# EAGLE design DFF_1_0 (EAGLE 8.3.2)
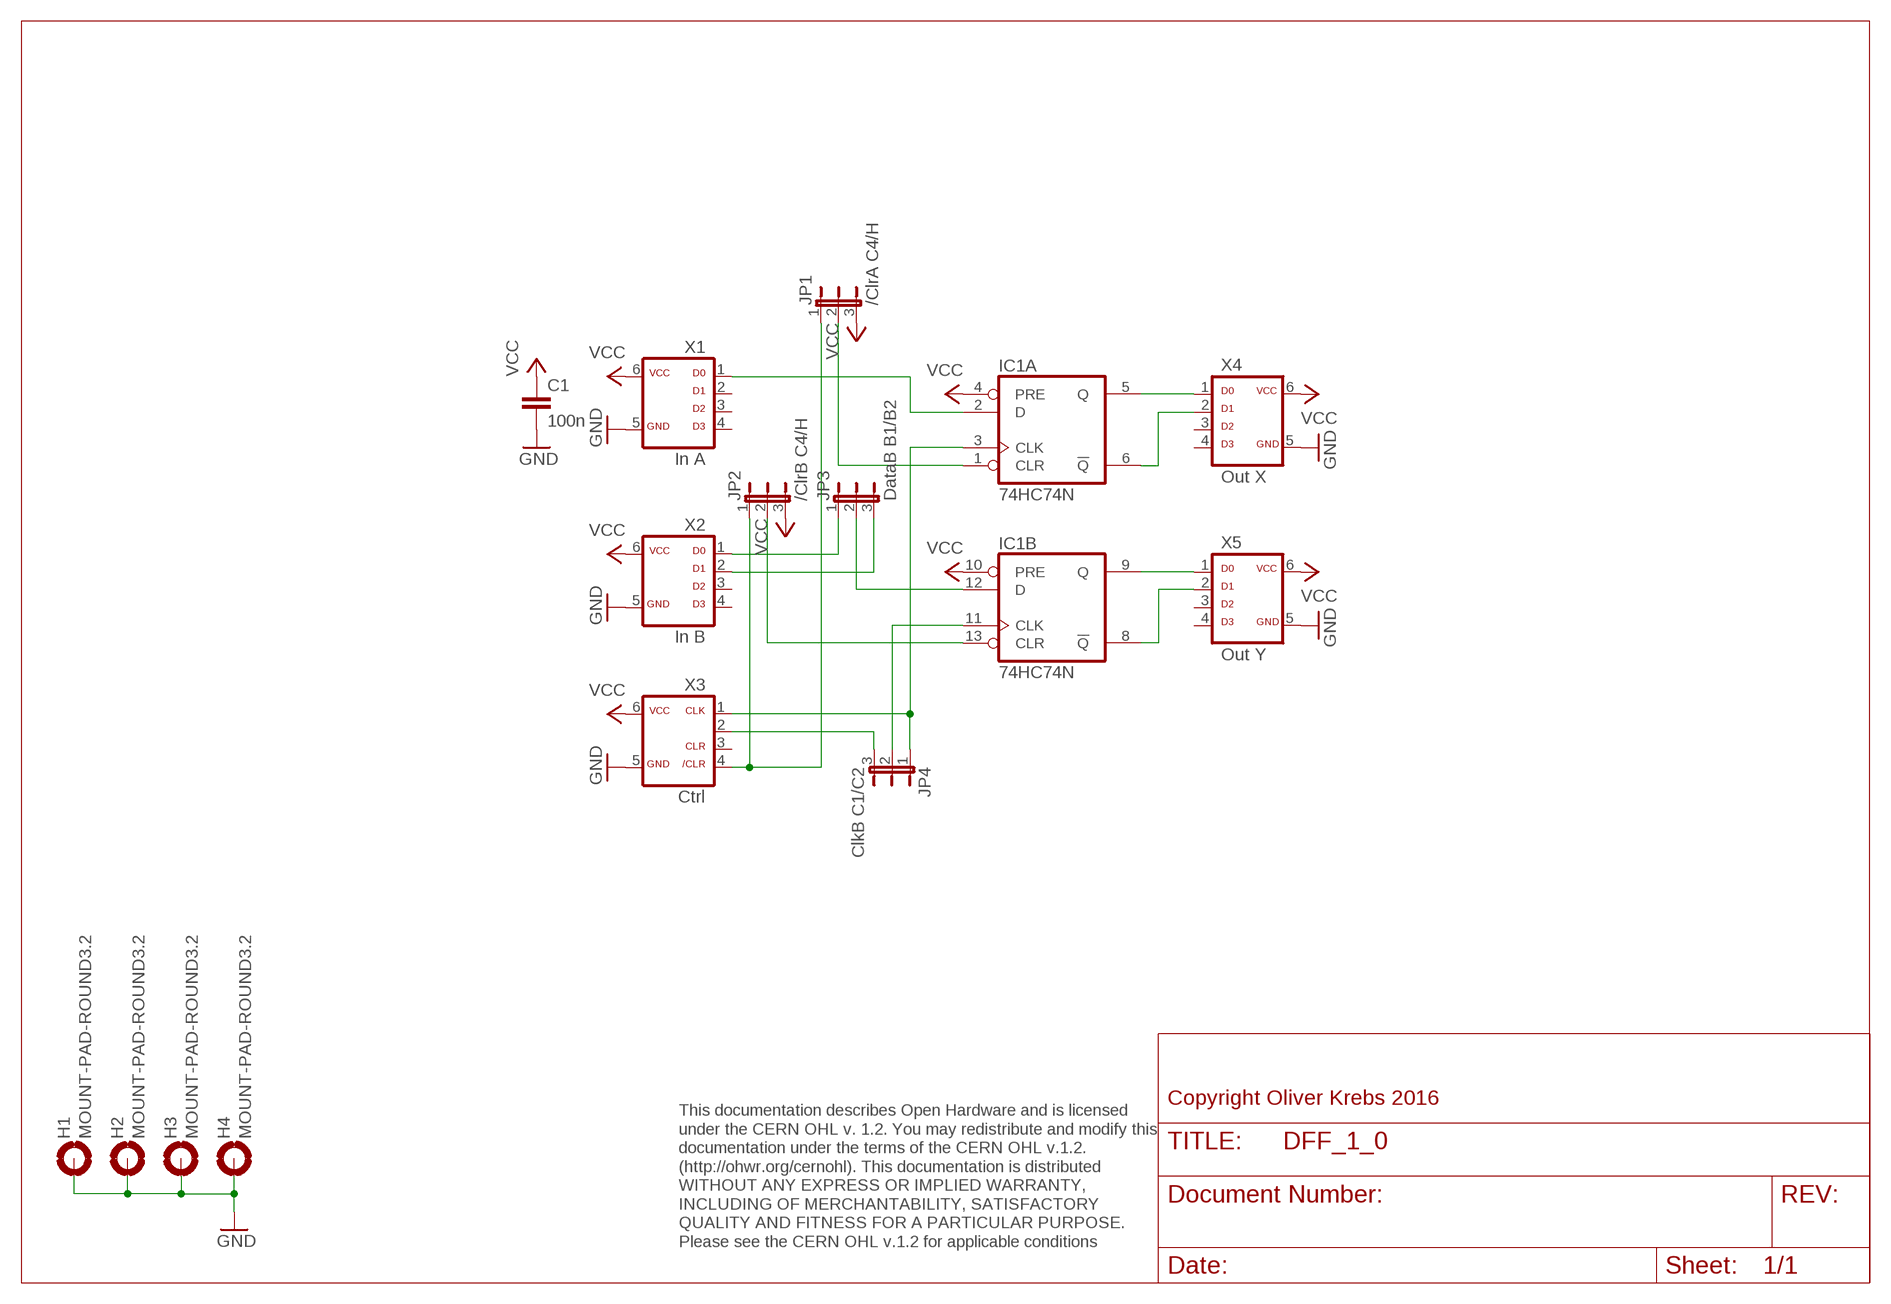
[diagram p0: schematic, sheet 1]

## Parts
C1  100n  C-EU050-025X075  [C050-025X075]
H1  MOUNT-PAD-ROUND3.2  [3,2-PAD]
H2  MOUNT-PAD-ROUND3.2  [3,2-PAD]
H3  MOUNT-PAD-ROUND3.2  [3,2-PAD]
H4  MOUNT-PAD-ROUND3.2  [3,2-PAD]
IC1  74HC74N  [DIL14]
JP1  /ClrA C4/H  JP2EJP2-U  [JP2-U]
JP2  /ClrB C4/H  JP2EJP2-U  [JP2-U]
JP3  DataB B1/B2  JP2EJP2-U  [JP2-U]
JP4  ClkB C1/C2  JP2EJP2-U  [JP2-U]
X1  In A  ML6D  [ML-6]
X2  In B  ML6D  [ML-6]
X3  Ctrl  ML6C  [ML-6]
X4  Out X  ML6D  [ML-6]
X5  Out Y  ML6D  [ML-6]

## Nets
GND: C1.2 H1.B3,2(MOUNT) H2.B3,2(MOUNT) H3.B3,2(MOUNT) H4.B3,2(MOUNT) X1.5 X2.5 X3.5 X4.5 X5.5
N$1: IC1.2(A:D) X1.1
N$2: IC1.3(A:CLK) JP4.1 X3.1
N$3: IC1.11(B:CLK) JP4.2
N$4: IC1.12(B:D) JP3.2
N$5: IC1.13(B:CLR) JP2.2
N$6: IC1.1(A:CLR) JP1.2
N$7: IC1.5(A:Q) X4.1
N$8: IC1.6(A:!Q) X4.2
N$9: IC1.9(B:Q) X5.1
N$10: IC1.8(B:!Q) X5.2
N$11: JP1.1 JP2.1 X3.4
N$12: JP3.1 X2.1
N$13: JP3.3 X2.2
N$15: JP4.3 X3.2
VCC: C1.1 IC1.4(A:PRE) IC1.10(B:PRE) JP1.3 JP2.3 X1.6 X2.6 X3.6 X4.6 X5.6
Unconnected: X1.2 X1.3 X1.4 X2.3 X2.4 X3.3 X4.3 X4.4 X5.3 X5.4

## Notes on the sheet
- Copyright Oliver Krebs 2016
- This documentation describes Open Hardware and is licensed 
  under the CERN OHL v. 1.2. You may redistribute and modify this 
  documentation under the terms of the CERN OHL v.1.2. 
  (http://ohwr.org/cernohl). This documentation is distributed
  WITHOUT ANY EXPRESS OR IMPLIED WARRANTY, 
  INCLUDING OF MERCHANTABILITY, SATISFACTORY 
  QUALITY AND FITNESS FOR A PARTICULAR PURPOSE. 
  Please see the CERN OHL v.1.2 for applicable conditions

## Power pins joined to a net without a drawn wire
GND: IC1.7(P:GND)
VCC: IC1.14(P:VCC)

## Library data of the parts
C1 = 01-my_rcl:C-EU: CAPACITOR, European symbol
H1-H4 = holes:MOUNT-PAD-ROUND: MOUNTING PAD, round
IC1 = 74xx-eu:74*74: Dual D type positive edge triggered FLIP FLOP, preset and clear
JP1-JP4 = 01-my-jumper:JP2E: JUMPER
X1 X2 X4 X5 = 01-my-con:ML6D
X3 = 01-my-con:ML6C

## Board
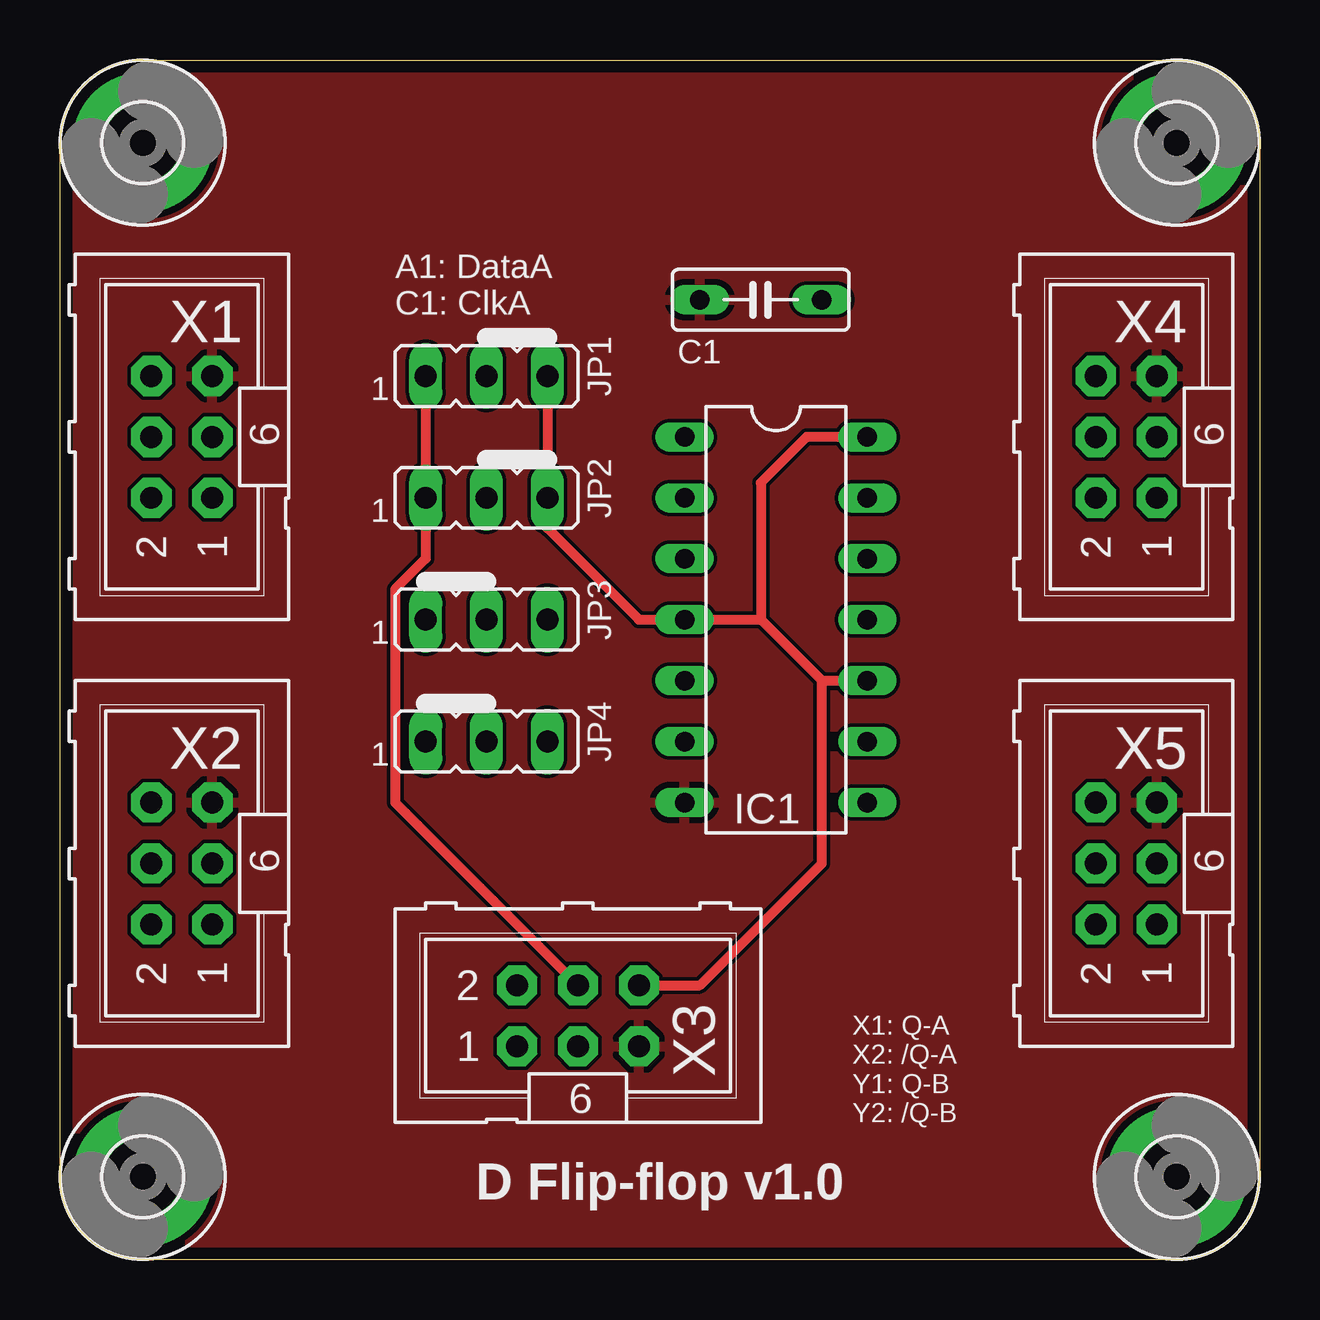
[diagram p1: board, top side]
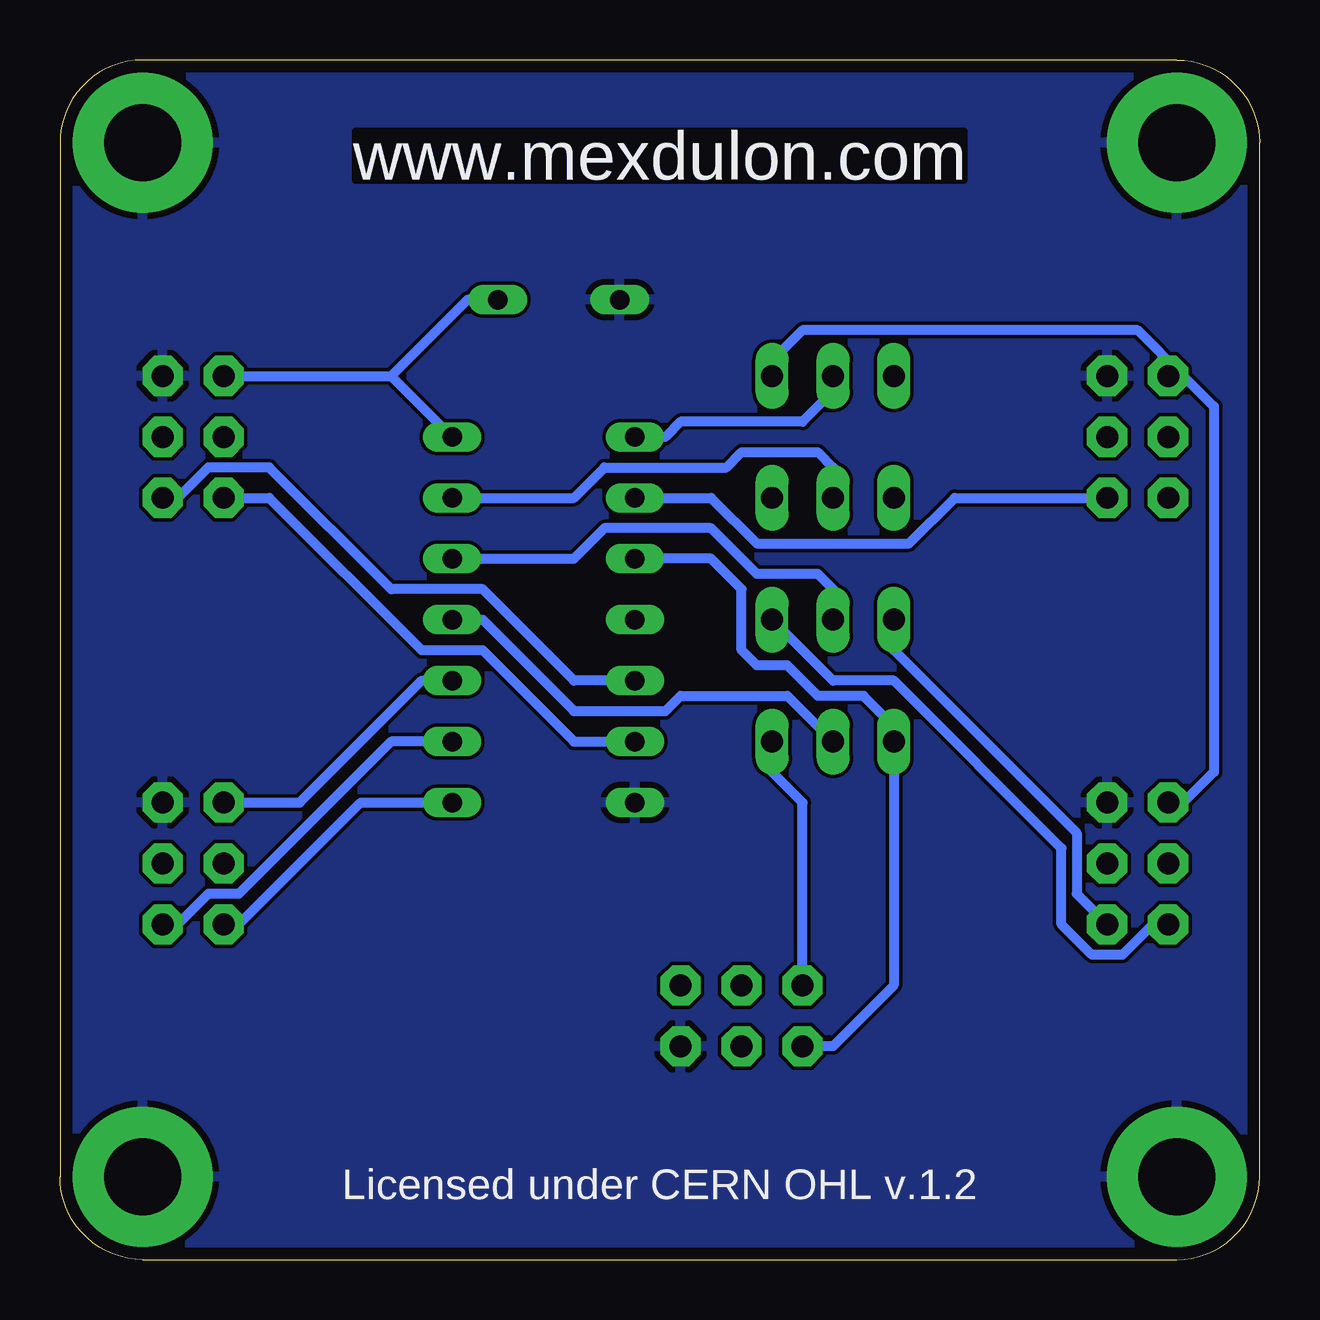
[diagram p2: board, bottom side, seen from below]

Size 50 x 50 mm. Coordinates in mm from the lower left corner, seen from the top.
Outline: 0,3.45 0,46.55 arc-90 3.45,50 46.55,50 arc-90 50,46.55 50,3.45 arc-90 46.55,0 3.45,0 arc-90 0,3.45
Copper layers (1*16): Top 0.035mm / dielectric 1.6mm / Bottom 0.035mm
Design rules "Elecrow_2-layer_PCB_eagle_rule": minimum track width 6mil, minimum drill 12mil, track to track 6mil, track to pad 6mil, pad to pad 6mil, via to via 8mil, smd to smd 0mil, copper to edge 20mil, drill to drill 10mil, minimum pad ring 6mil, minimum via ring 6mil, stop-mask expansion 0mil, vias tented up to drill 100mil, thermal gap 10mil

### Footprints (pad centres in the part's own frame; a part is rotated, then mirrored left to right if it is on the bottom)
C050-025X075 = drill 0.813 long: 1 -2.54,0; 2 2.54,0
3,2-PAD = drill 3.2 pad 5.842: B3,2 0,0
DIL14 = drill 0.813 long: 1 -7.62,-3.81; 2 -5.08,-3.81; 3 -2.54,-3.81; 4 0,-3.81; 5 2.54,-3.81; 6 5.08,-3.81; 7 7.62,-3.81; 8 7.62,3.81; 9 5.08,3.81; 10 2.54,3.81; 11 0,3.81; 12 -2.54,3.81; 13 -5.08,3.81; 14 -7.62,3.81
JP2-U = drill 0.914 long: 1 -2.54,0; 2 0,0; 3 2.54,0
ML-6 = drill 0.914 pad 1.676 octagon: 1 -2.54,-1.27; 2 -2.54,1.27; 3 0,-1.27; 4 0,1.27; 5 2.54,-1.27; 6 2.54,1.27

### Placement (x,y rotation side)
C1  29.21,40.01 180 top
H1  3.45,3.45 0 top
H2  3.45,46.55 0 top
H3  46.55,3.45 0 top
H4  46.55,46.55 0 top
IC1  29.84,26.67 270 top
JP1  17.78,36.83 0 top
JP2  17.78,31.75 0 top
JP3  17.78,26.67 0 top
JP4  17.78,21.59 0 top
X1  5.08,34.29 90 top
X2  5.08,16.51 90 top
X3  21.59,10.16 0 top
X4  44.45,34.29 90 top
X5  44.45,16.51 90 top

### Tracks (layer width: path | path; a pad name or v marks a point on that pad's centre or on a via)
GND
  pour Bottom: -0.17,0 -0.17,50.16 50,50.16 50,0
  pour Top: -0.17,0 -0.17,50.16 50,50.16 50,0
N$1
  Bottom 0.406: IC1.2 22.86,31.75 20.95,29.84 14.61,29.84 12.7,31.75 X1.1
N$2
  Bottom 0.406: X3.1 17.78,8.89 15.24,11.43 JP4.1 15.24,22.23 16.51,23.5 18.41,23.5 19.68,24.77 20.95,24.77 21.59,25.4 21.59,27.94 22.86,29.21 IC1.3
N$3
  Bottom 0.406: IC1.11 32.38,26.67 28.57,22.86 24.77,22.86 24.13,23.5 19.68,23.5 JP4.2
N$4
  Bottom 0.406: IC1.12 28.57,29.21 27.3,30.48 22.86,30.48 20.95,28.57 18.41,28.57 17.78,27.94 JP3.2
N$5
  Bottom 0.406: IC1.13 28.57,31.75 27.3,33.02 22.23,33.02 21.59,33.66 18.41,33.66 17.78,33.02 JP2.2
N$6
  Bottom 0.406: JP1.2 17.78,36.2 19.05,34.92 24.13,34.92 24.77,34.29 IC1.1
N$7
  Bottom 0.406: IC1.5 28.57,24.13 32.38,27.94 36.2,27.94 41.27,33.02 43.81,33.02 45.09,31.75 X4.1
N$8
  Bottom 0.406: X4.2 41.27,31.75 34.92,25.4 32.38,25.4 28.57,21.59 IC1.6
N$9
  Bottom 0.406: IC1.9 36.2,21.59 42.55,15.24 43.81,15.24 45.09,13.97 X5.1
N$10
  Bottom 0.406: X5.2 42.55,13.97 37.47,19.05 IC1.8
N$11
  Top 0.406: JP1.1 JP2.1 15.24,29.21 13.97,27.94 13.97,19.05 X3.4
N$12
  Bottom 0.406: JP3.1 15.24,25.4 7.62,17.78 7.62,15.24 X2.1
N$13
  Bottom 0.406: X2.2 4.45,13.97 5.71,12.7 6.99,12.7 8.26,13.97 8.26,17.14 15.24,24.13 17.78,24.13 JP3.3
N$15
  Bottom 0.406: X3.2 19.05,19.05 20.32,20.32 JP4.3
VCC
  Top 0.406: 29.21,26.67 IC1.4 24.13,26.67 20.32,30.48 JP2.3 JP1.3 | 29.21,26.67 31.75,24.13 | 31.75,24.13 IC1.10 | IC1.14 31.11,34.29 29.21,32.38 29.21,26.67 | X3.6 26.67,11.43 31.75,16.51 31.75,24.13
  Bottom 0.406: X4.6 36.2,36.83 | 36.2,36.83 IC1.14 | X5.6 40.01,19.05 34.92,24.13 IC1.10 | C1.1 33.02,40.01 36.2,36.83 | 3.17,36.83 5.08,38.73 19.05,38.73 20.32,37.47 JP1.3 | X1.6 3.17,36.83 | 3.17,36.83 1.91,35.56 1.91,20.32 3.17,19.05 X2.6

### Text on the board
Bottom: www.mexdulon.com
tNames: A1: DataA / C1: ClkA | X1: Q-A / X2: /Q-A / Y1: Q-B / Y2: /Q-B | D Flip-flop v1.0
bNames: www.mexdulon.com | Licensed under CERN OHL v.1.2
200bmp: E:/Bilder/Elektronik/Modulion/Mexdulon/mexdulon_50x50_pcb.bmp